# EAGLE schematic EagleIO (copy) (EAGLE 7.2.0)

## Sheet 1 of 4
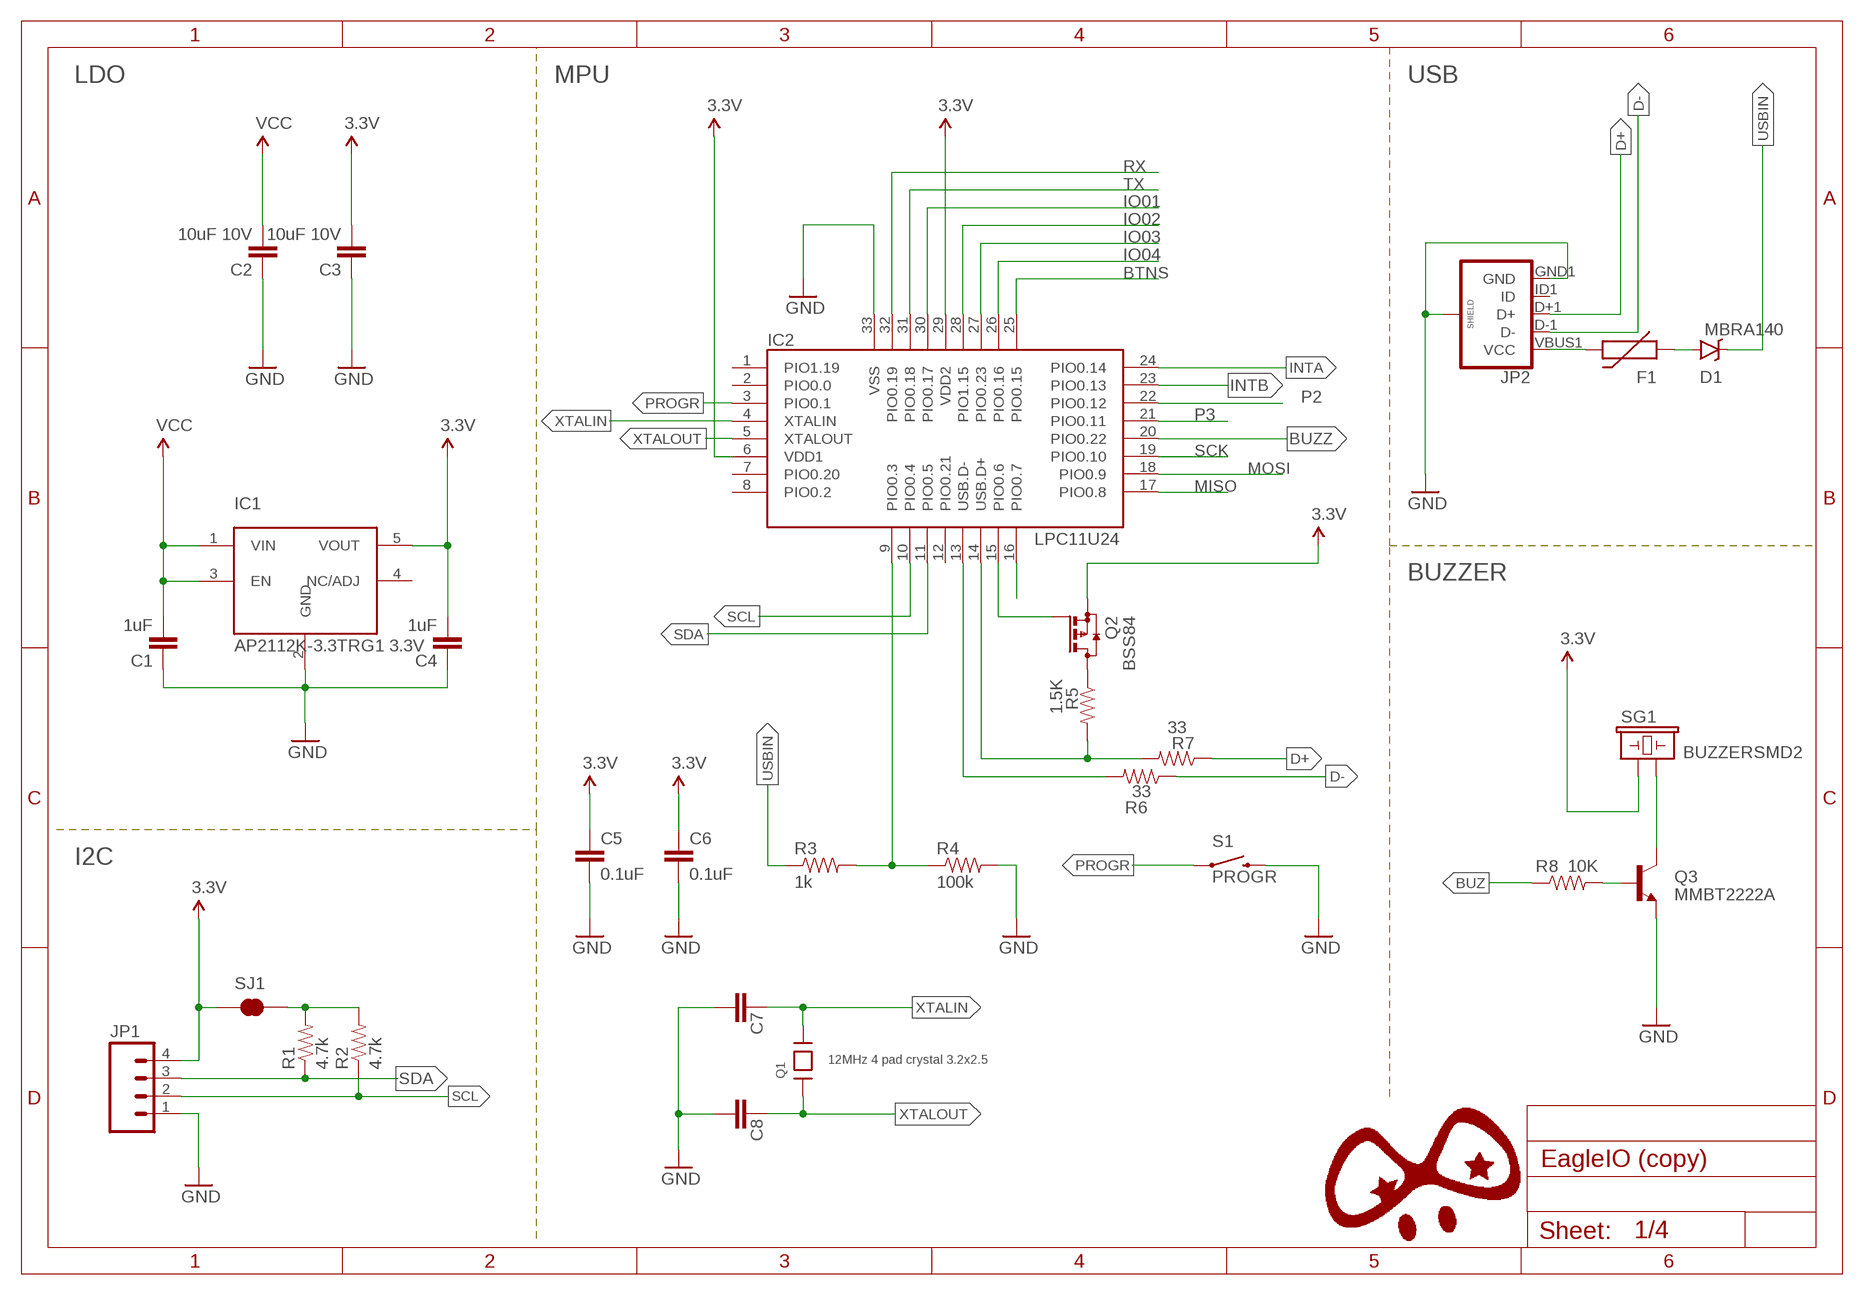
[diagram p0: schematic, sheet 1]

### Parts
C1  1uF  CAP0402-CAP  [0402-CAP]
C2  10uF 10V  CAP0402-CAP  [0402-CAP]
C3  10uF 10V  CAP0402-CAP  [0402-CAP]
C4  1uF  CAP0402-CAP  [0402-CAP]
C5  0.1uF  CAP0402-CAP  [0402-CAP]
C6  0.1uF  CAP0402-CAP  [0402-CAP]
C7  27pF  CAP0402-CAP  [0402-CAP]
C8  27pF  CAP0402-CAP  [0402-CAP]
D1  MBRA140  [SMA-DIODE]
F1  PTC0603  [0603]
IC1  AP2112K-3.3TRG1 3.3V  5PIN_REG  [SOT23-5]
IC2  LPC11U24  LPC11U2X_HVQFN33(5X5)  [HVQFN33_5X5MM]
JP1  M04LONGPADS  [1X04_LONGPADS]
JP2  USB_MICROB_PLUGCONN-11752  [USB-B-MICRO-SMD_V03]
Q1  12MHz 4 pad crystal 3.2x2.5  CRYSTAL3.2X2.5  [CRYSTAL_3.2X2.5]
Q2  BSS84  [SOT23]
Q3  MMBT2222A  TRANSISTOR_NPNMMBT2222A  [SOT23-3]
R1  4.7k  RESISTOR0402-RES  [0402-RES]
R2  4.7k  RESISTOR0402-RES  [0402-RES]
R3  1k  RESISTOR0402-RES  [0402-RES]
R4  100k  RESISTOR0402-RES  [0402-RES]
R5  1.5K  RESISTOR0402-RES  [0402-RES]
R6  33  RESISTOR0402-RES  [0402-RES]
R7  33  RESISTOR0402-RES  [0402-RES]
R8  10K  RESISTOR0402-RES  [0402-RES]
S1  PROGR  SWITCH-MOMENTARY-2SMD-1101NE  [TACTILE-SWITCH-1101NE]
SG1  BUZZERSMD2  [BUZZER-CCV]
SJ1  JUMPER-PAD-2-NC_BY_TRACE  [PAD-JUMPER-2-NC_BY_TRACE_YES_SILK]

### Nets
3.3V: C3.2 C4.2 C5.1 C6.1 IC1.5(VOUT) IC2.6(VDD1) IC2.29(VDD2) JP1.4 Q2.2(S) SG1.+ SJ1.1 ; also sheet 2,3,4
BTNS: IC2.25(PIO0.15)
BUZ: R8.1
BUZZ: IC2.20(PIO0.22)
D+: JP2.D+1(D+) R7.1
D-: JP2.D-1(D-) R6.1
GND: C1.1 C2.1 C3.1 C4.1 C5.2 C6.2 C7.2 C8.2 IC1.2(GND) IC2.33(VSS) JP1.1 JP2.GND1(GND) JP2.SHIELD1(SHIELD) JP2.SHIELD2(SHIELD) JP2.SHIELD3(SHIELD) Q3.2(E) R4.2 S1.2 ; also sheet 2,3,4
INTA: IC2.24(PIO0.14) ; also sheet 2
INTB: IC2.23(PIO0.13) ; also sheet 2
IO01: IC2.30(PIO0.17)
IO02: IC2.28(PIO1.15)
IO03: IC2.27(PIO0.23)
IO04: IC2.26(PIO0.16)
MISO: IC2.17(PIO0.8)
MOSI: IC2.18(PIO0.9)
N$20: D1.A F1.1
N$21: F1.2 JP2.VBUS1(VCC)
N$28: Q3.3(C) SG1.-
N$30: Q3.1(B) R8.2
N$33: IC2.14(USB.D+) R5.2 R7.2
N$34: IC2.13(USB.D-) R6.2
N$35: Q2.3(D) R5.1
N$36: IC2.15(PIO0.6) Q2.1(G)
N$37 [power]: R1.2 R2.2 SJ1.2
P0.3/ISP_COMMAND_USB_HIGH: IC2.9(PIO0.3) R3.2 R4.1
P2: IC2.22(PIO0.12)
P3: IC2.21(PIO0.11)
PROGR: IC2.3(PIO0.1) S1.1
RX: IC2.32(PIO0.19)
SCK: IC2.19(PIO0.10)
SCL: IC2.10(PIO0.4) JP1.2 R2.1 ; also sheet 2,4
SDA: IC2.11(PIO0.5) JP1.3 R1.1 ; also sheet 2,4
TX: IC2.31(PIO0.18)
USBIN: D1.C R3.1
USRBTN: IC2.16(PIO0.7)
VCC: C1.2 C2.2 IC1.1(VIN) IC1.3(EN)
XTALIN: C7.1 IC2.4(XTALIN) Q1.3
XTALOUT: C8.1 IC2.5(XTALOUT) Q1.1
Unconnected: IC1.4(NC/ADJ) IC2.1(PIO1.19) IC2.2(PIO0.0) IC2.7(PIO0.20) IC2.8(PIO0.2) IC2.12(PIO0.21) JP2.ID1(ID)

### Notes on the sheet
- LDO | MPU | USB
- BUZZER
- I2C

## Sheet 2 of 4
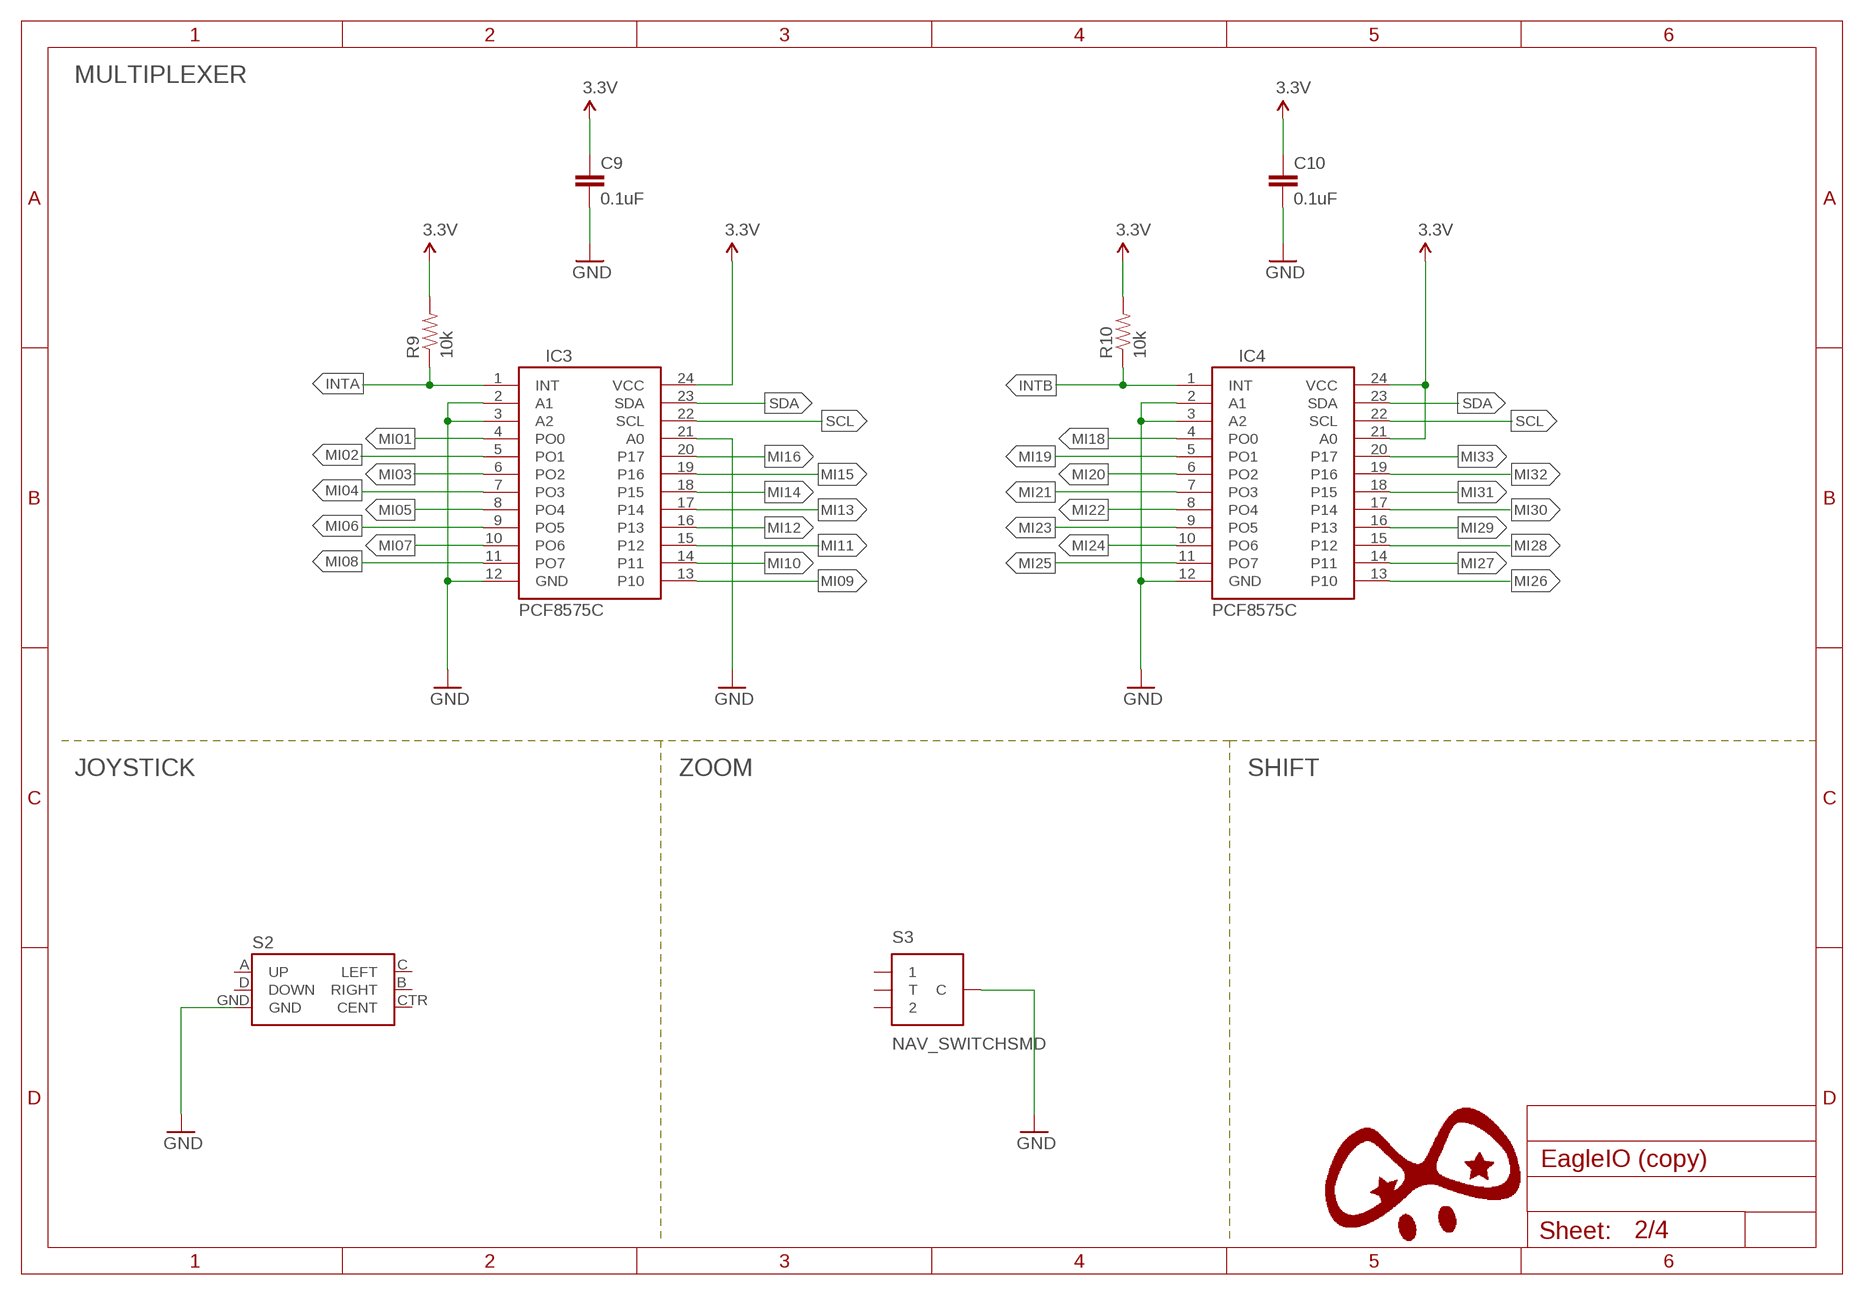
[diagram p1: schematic, sheet 2]

### Parts
C9  0.1uF  CAP0402-CAP  [0402-CAP]
C10  0.1uF  CAP0402-CAP  [0402-CAP]
IC3  PCF8575C  [SO-24DW]
IC4  PCF8575C  [SO-24DW]
R9  10k  RESISTOR0402-RES  [0402-RES]
R10  10k  RESISTOR0402-RES  [0402-RES]
S2  JOYSTICK_MINI  [JOYSTICK_MINI]
S3  NAV_SWITCHSMD  [NAV_SWITCH]

### Nets
3.3V: C9.1 C10.1 IC3.24(VCC) IC4.21(A0) IC4.24(VCC) R9.2 R10.2 ; also sheet 1,3,4
GND: C9.2 C10.2 IC3.2(A1) IC3.3(A2) IC3.12(GND) IC3.21(A0) IC4.2(A1) IC4.3(A2) IC4.12(GND) S2.GND S3.C ; also sheet 1,3,4
INTA: IC3.1(INT) R9.1 ; also sheet 1
INTB: IC4.1(INT) R10.1 ; also sheet 1
MI01: IC3.4(PO0)
MI02: IC3.5(PO1)
MI03: IC3.6(PO2)
MI04: IC3.7(PO3)
MI05: IC3.8(PO4)
MI06: IC3.9(PO5)
MI07: IC3.10(PO6)
MI08: IC3.11(PO7)
MI09: IC3.13(P10)
MI10: IC3.14(P11)
MI11: IC3.15(P12)
MI12: IC3.16(P13)
MI13: IC3.17(P14)
MI14: IC3.18(P15)
MI15: IC3.19(P16)
MI16: IC3.20(P17)
MI18: IC4.4(PO0)
MI19: IC4.5(PO1)
MI20: IC4.6(PO2)
MI21: IC4.7(PO3)
MI22: IC4.8(PO4)
MI23: IC4.9(PO5)
MI24: IC4.10(PO6)
MI25: IC4.11(PO7)
MI26: IC4.13(P10)
MI27: IC4.14(P11)
MI28: IC4.15(P12)
MI29: IC4.16(P13)
MI30: IC4.17(P14)
MI31: IC4.18(P15)
MI32: IC4.19(P16)
MI33: IC4.20(P17)
SCL: IC3.22(SCL) IC4.22(SCL) ; also sheet 1,4
SDA: IC3.23(SDA) IC4.23(SDA) ; also sheet 1,4
Unconnected: S2.A(UP) S2.B(RIGHT) S2.C(LEFT) S2.CTR(CENT) S2.D(DOWN) S3.1 S3.2 S3.T

### Notes on the sheet
- MULTIPLEXER
- JOYSTICK | ZOOM | SHIFT

## Sheet 3 of 4
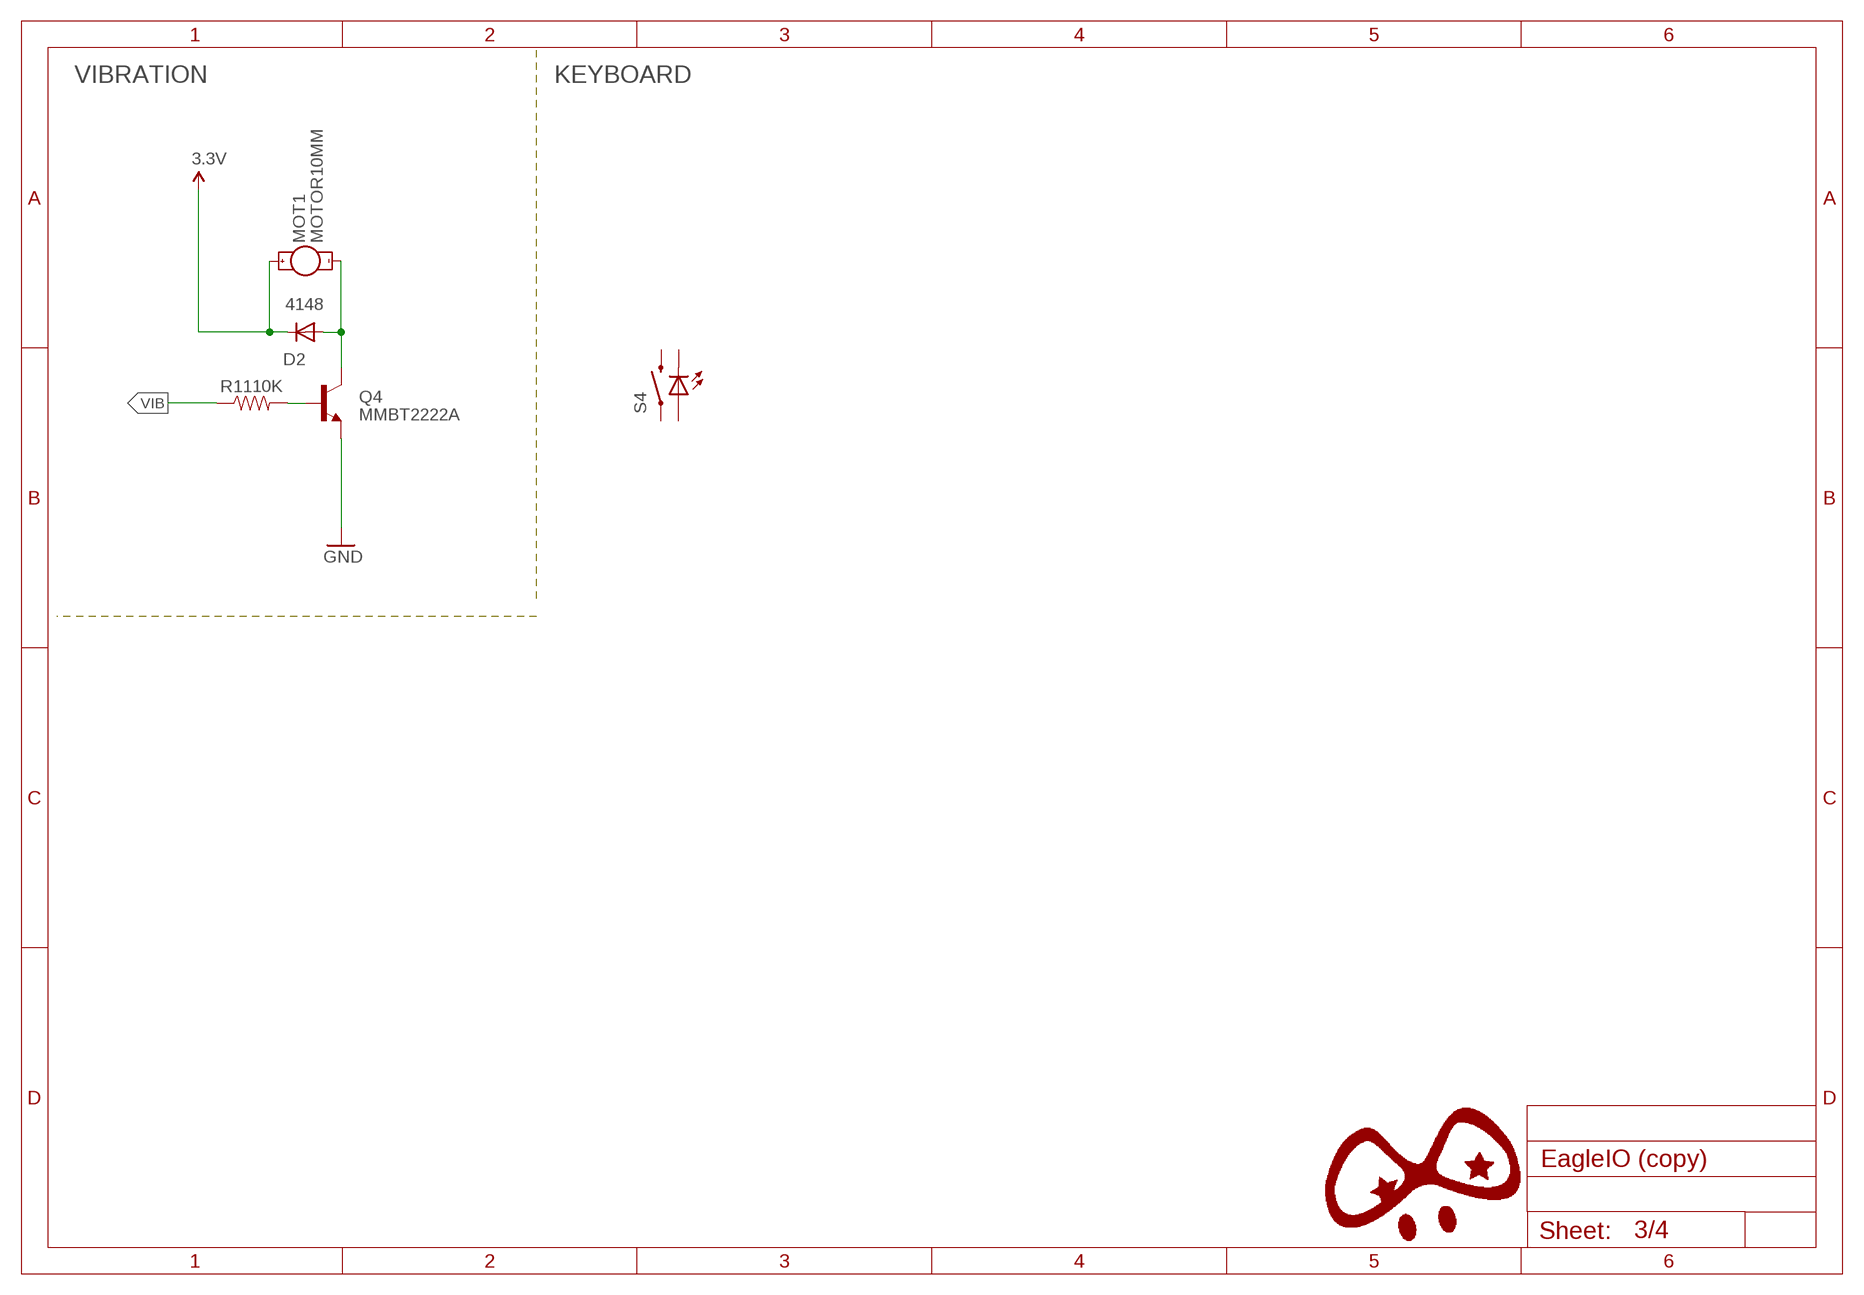
[diagram p2: schematic, sheet 3]

### Parts
D2  4148  DIODE-MINIMELF  [MINIMELF]
MOT1  MOTOR10MM  [VIBE-MOTOR-10MM]
Q4  MMBT2222A  TRANSISTOR_NPNMMBT2222A  [SOT23-3]
R11  10K  RESISTOR0402-RES  [0402-RES]
S4  SWITCH-MOMENTARY-LEDPTH  [TACTILE-PTH-LED-12MM]

### Nets
3.3V: D2.C MOT1.+ ; also sheet 1,2,4
GND: Q4.2(E) ; also sheet 1,2,4
N$1: D2.A MOT1.- Q4.3(C)
N$2: Q4.1(B) R11.2
VIB: R11.1
Unconnected: S4.2 S4.4 S4.A S4.C

### Notes on the sheet
- VIBRATION | KEYBOARD

## Sheet 4 of 4
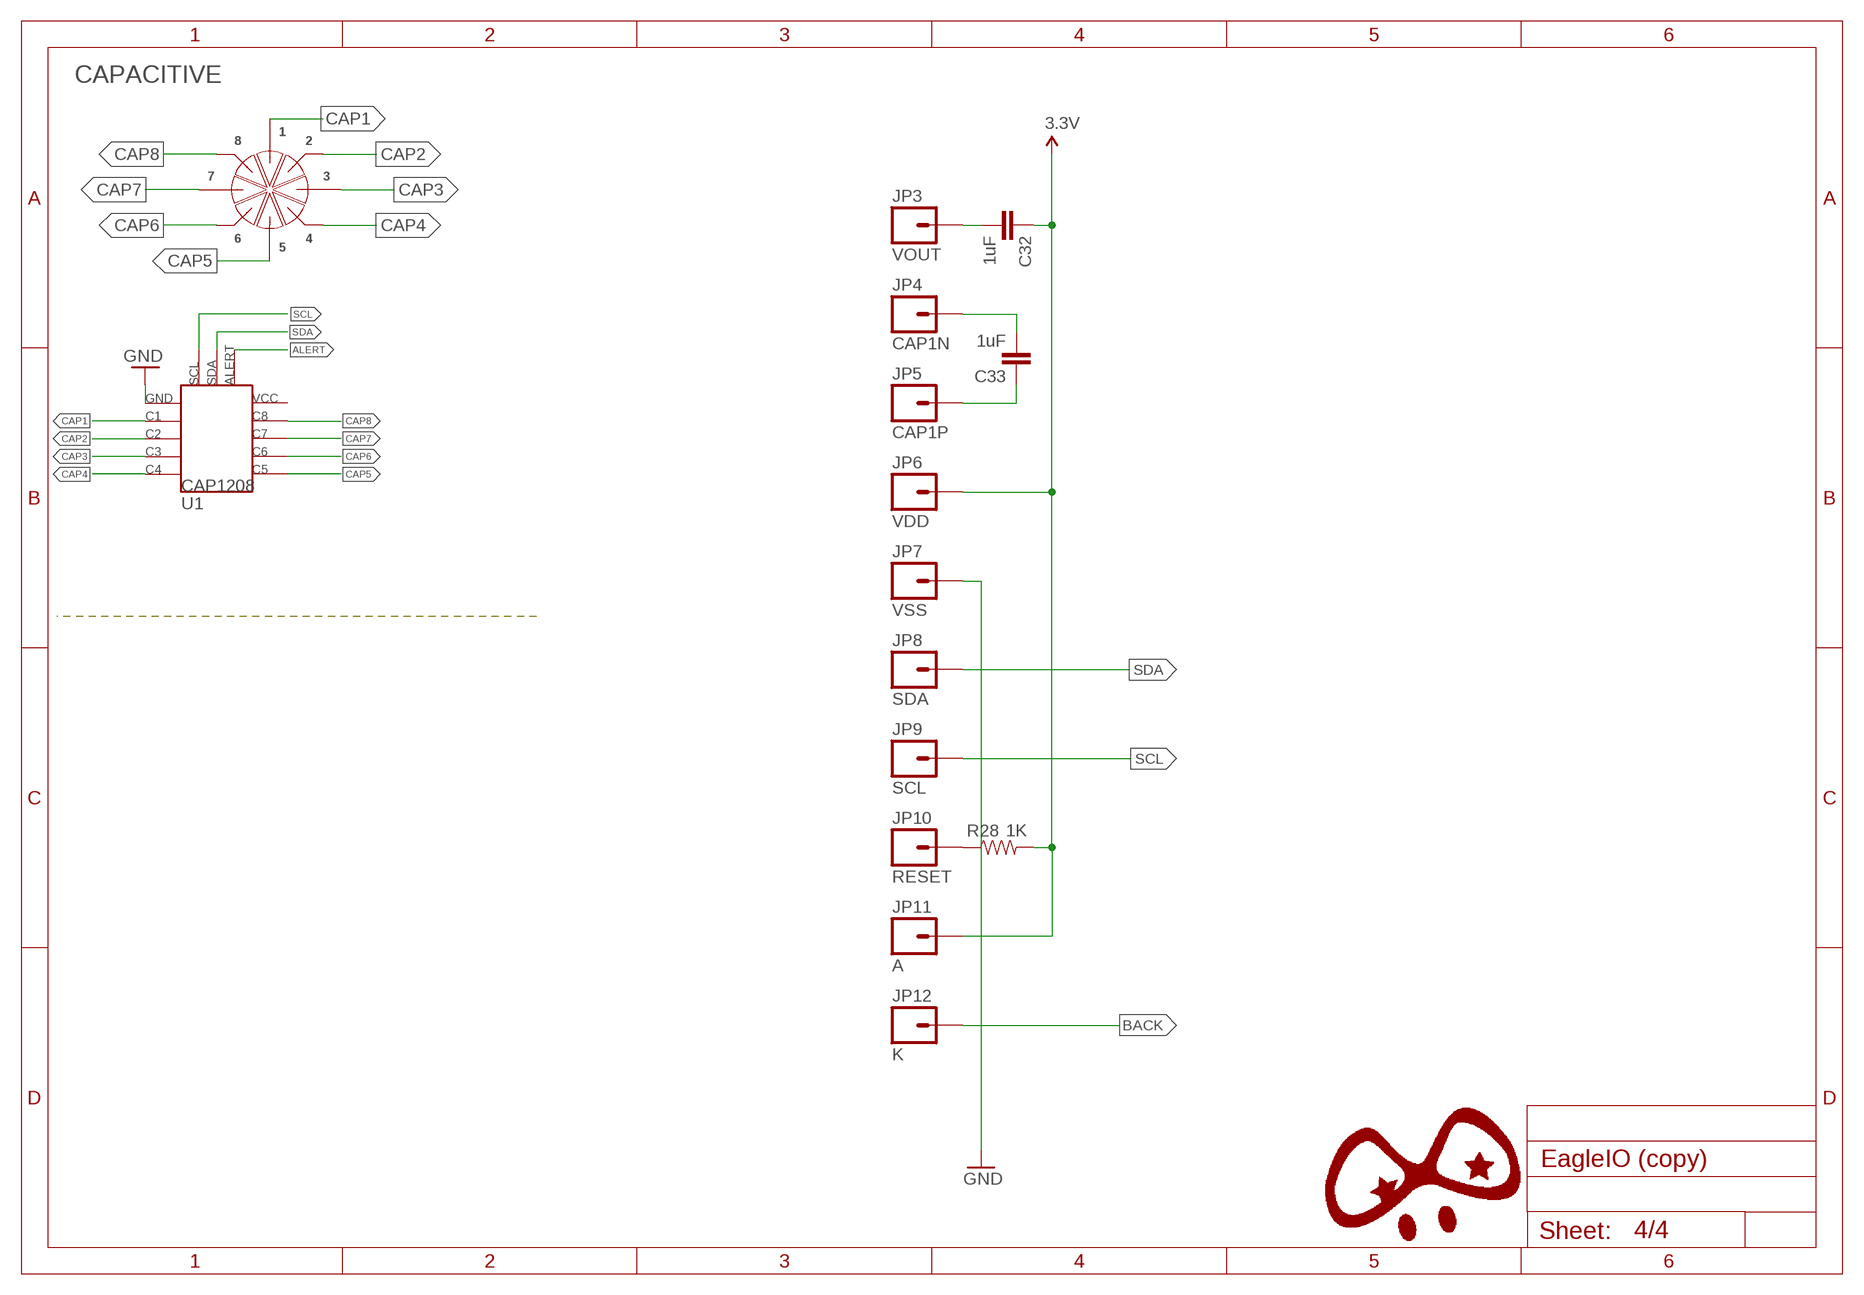
[diagram p3: schematic, sheet 4]

### Parts
C32  1uF  CAP0402-CAP  [0402-CAP]
C33  1uF  CAP0402-CAP  [0402-CAP]
JP3  VOUT  M01NOSILK-KIT  [1X01NS-KIT]
JP4  CAP1N  M01NOSILK-KIT  [1X01NS-KIT]
JP5  CAP1P  M01NOSILK-KIT  [1X01NS-KIT]
JP6  VDD  M01NOSILK-KIT  [1X01NS-KIT]
JP7  VSS  M01NOSILK-KIT  [1X01NS-KIT]
JP8  SDA  M01NOSILK-KIT  [1X01NS-KIT]
JP9  SCL  M01NOSILK-KIT  [1X01NS-KIT]
JP10  RESET  M01NOSILK-KIT  [1X01NS-KIT]
JP11  A  M01NOSILK-KIT  [1X01NS-KIT]
JP12  K  M01NOSILK-KIT  [1X01NS-KIT]
R28  1K  RESISTOR0402-RES  [0402-RES]
U1  CAP1208  [QFN_16]
W1  CAP_WHEEL  [CAP_WHEEL]

### Nets
3.3V: C32.1 JP6.1 JP11.1 R28.2 ; also sheet 1,2,3
ALERT: U1.1(ALERT)
BACK: JP12.1
CAP1: U1.16(C1) W1.1
CAP2: U1.15(C2) W1.2
CAP3: U1.14(C3) W1.3
CAP4: U1.13(C4) W1.4
CAP5: U1.12(C5) W1.5
CAP6: U1.11(C6) W1.6
CAP7: U1.10(C7) W1.7
CAP8: U1.9(C8) W1.8
GND: JP7.1 U1.7(GND) U1.8(GND) U1.EXT(GND) ; also sheet 1,2,3
N$3: C33.2 JP4.1
N$4: C33.1 JP5.1
N$5: C32.2 JP3.1
N$7: JP10.1 R28.1
SCL: JP9.1 U1.3(SCL) ; also sheet 1,2
SDA: JP8.1 U1.2(SDA) ; also sheet 1,2
Unconnected: U1.4(VCC)

### Notes on the sheet
- CAPACITIVE

## Library data of the parts
C1-C10 C32 C33 = SparkFun-Passives:CAP: Capacitor Standard 0603 ceramic capacitor, and 0.1" leaded capacitor.
D1 = SparkFun-DiscreteSemi:MBRA140: 40V, 1A Schottky rectifier SMA/DO-214AC package DIO-08053; PROD_ID: DIO-08053
D2 = diode:DIODE-: DIODE
F1 = SparkFun-PowerIC:PTC: Resettable Fuse PTC Resettable Fuse. Spark Fun Electronics SKU : COM-08357
IC1 = GHI:5PIN_REG
IC2 = GHI-SoMs-Processors:LPC11U2X_HVQFN33(5X5)
IC3 IC4 = SparkFun-DigitalIC:PCF8575C: PCF8575C I/O Expander.
JP1 = SparkFun-Connectors:M04: Header 4 Standard 4-pin 0.1" header. Use with straight break away headers (SKU : PRT-00116), right angle break away headers (PRT-00553), swiss pins (PRT-00743), machine pins (PRT-00117), and female headers (PRT-00115). Molex polarized connector foot print use with SKU : PRT-08231 with associated crimp pins and housings. 1MM SMD Version SKU: PRT-10208
JP2 = SparkFun-Connectors:USB_MICROB_PLUG: USB Micro-B connectors Some male, some female. Watch your step!; PROD_ID: CONN-11752
JP3-JP12 = SparkFun-Connectors:M01: Header 1 Standard 1-pin 0.1" header. Use with straight break away headers (SKU : PRT-00116), right angle break away headers (PRT-00553), swiss pins (PRT-00743), machine pins (PRT-00117), and female headers (PRT-00115).
MOT1 = SparkFun-Electromechanical:MOTOR: Vibration Motor- ROB-08449 Physical dimension and wire connections for this powerful vibration motor. Motor has a self adhesive backing.
Q1 = GHI:CRYSTAL3.2X2.5
Q2 = transistor-small-signal:BSS84: P-CHANNEL MOS FET
Q3 Q4 = SparkFun-DiscreteSemi:TRANSISTOR_NPN: Generic NPN BJT MMBT2222A - TRANS-08049 (SOT-23, 1A 40V) MPSA42 - TRANS-09116 (SOT-23, 500mA 300V) MMBT5088LT1G - TRANS-11160 (SOT-23, 50 mA 30V) BC547 - COM-08928 <http://www.sparkfun.com/products/8928> (TO-92 45V 100mA) (1.Collector 2.Base 3.Emitter) 2N3904 - COM-00521 <http://www.sparkfun.com/products/521> (TO-92 40V 200mA) (1.Emitter 2.Base 3.Collector) P2N2222A - COM-12852 <http://www.sparkfun.com/products/12852> (TO-92 40V 600mA) (1.Collector 2.Base 3.Emitter); PROD_ID: TRANS-08049
R1-R7 R9 R10 = SparkFun-Passives:RESISTOR: Resistor Basic schematic elements and footprints for 0603, 1206, and PTH resistors.
R8 R11 R28 = SparkFun:RESISTOR: Resistor Basic schematic elements and footprints for 0603, 1206, and PTH resistors.
S1 = SparkFun-Electromechanical:SWITCH-MOMENTARY-2: Various NO switches- pushbuttons, reed, etc; PROD_ID: SWCH-00815
S2 = SparkFun-Electromechanical:JOYSTICK_MINI: Small 5-way tactile joystick, COM-10063 4UCON SF303GJ26; PROD_ID: SWCH-09905
S3 = SparkFun-Electromechanical:NAV_SWITCH: Navigation Switch Three way navigation switch. Commonly used as up/down/select on MP3 players. Schematic element and footprint production proven. Spark Fun Electronics SKU : COM-08184
S4 = SparkFun-Electromechanical:SWITCH-MOMENTARY-LED: EZ is for Kits. There is no tStop (covering up the top side of the pads with mask). This helps the beginner see which side they should be soldering too.
SG1 = SparkFun-Electromechanical:BUZZER: Buzzer 12mm Spark Fun Electronics SKU : Comp-Buzzer
SJ1 = SparkFun-Passives:JUMPER-PAD-2-NC_BY_TRACE
U1 = pighiXXX:CAP1208
W1 = pighiXXX:CAP_WHEEL: Capacitive wheel

## Net classes
0 default: width 0.254 mm, drill 0.254 mm, clearance 0.203 mm
1 power: width 0.61 mm, drill 0.61 mm, clearance 0.254 mm